# Altium project CT_Breakout_Board.PrjPCB
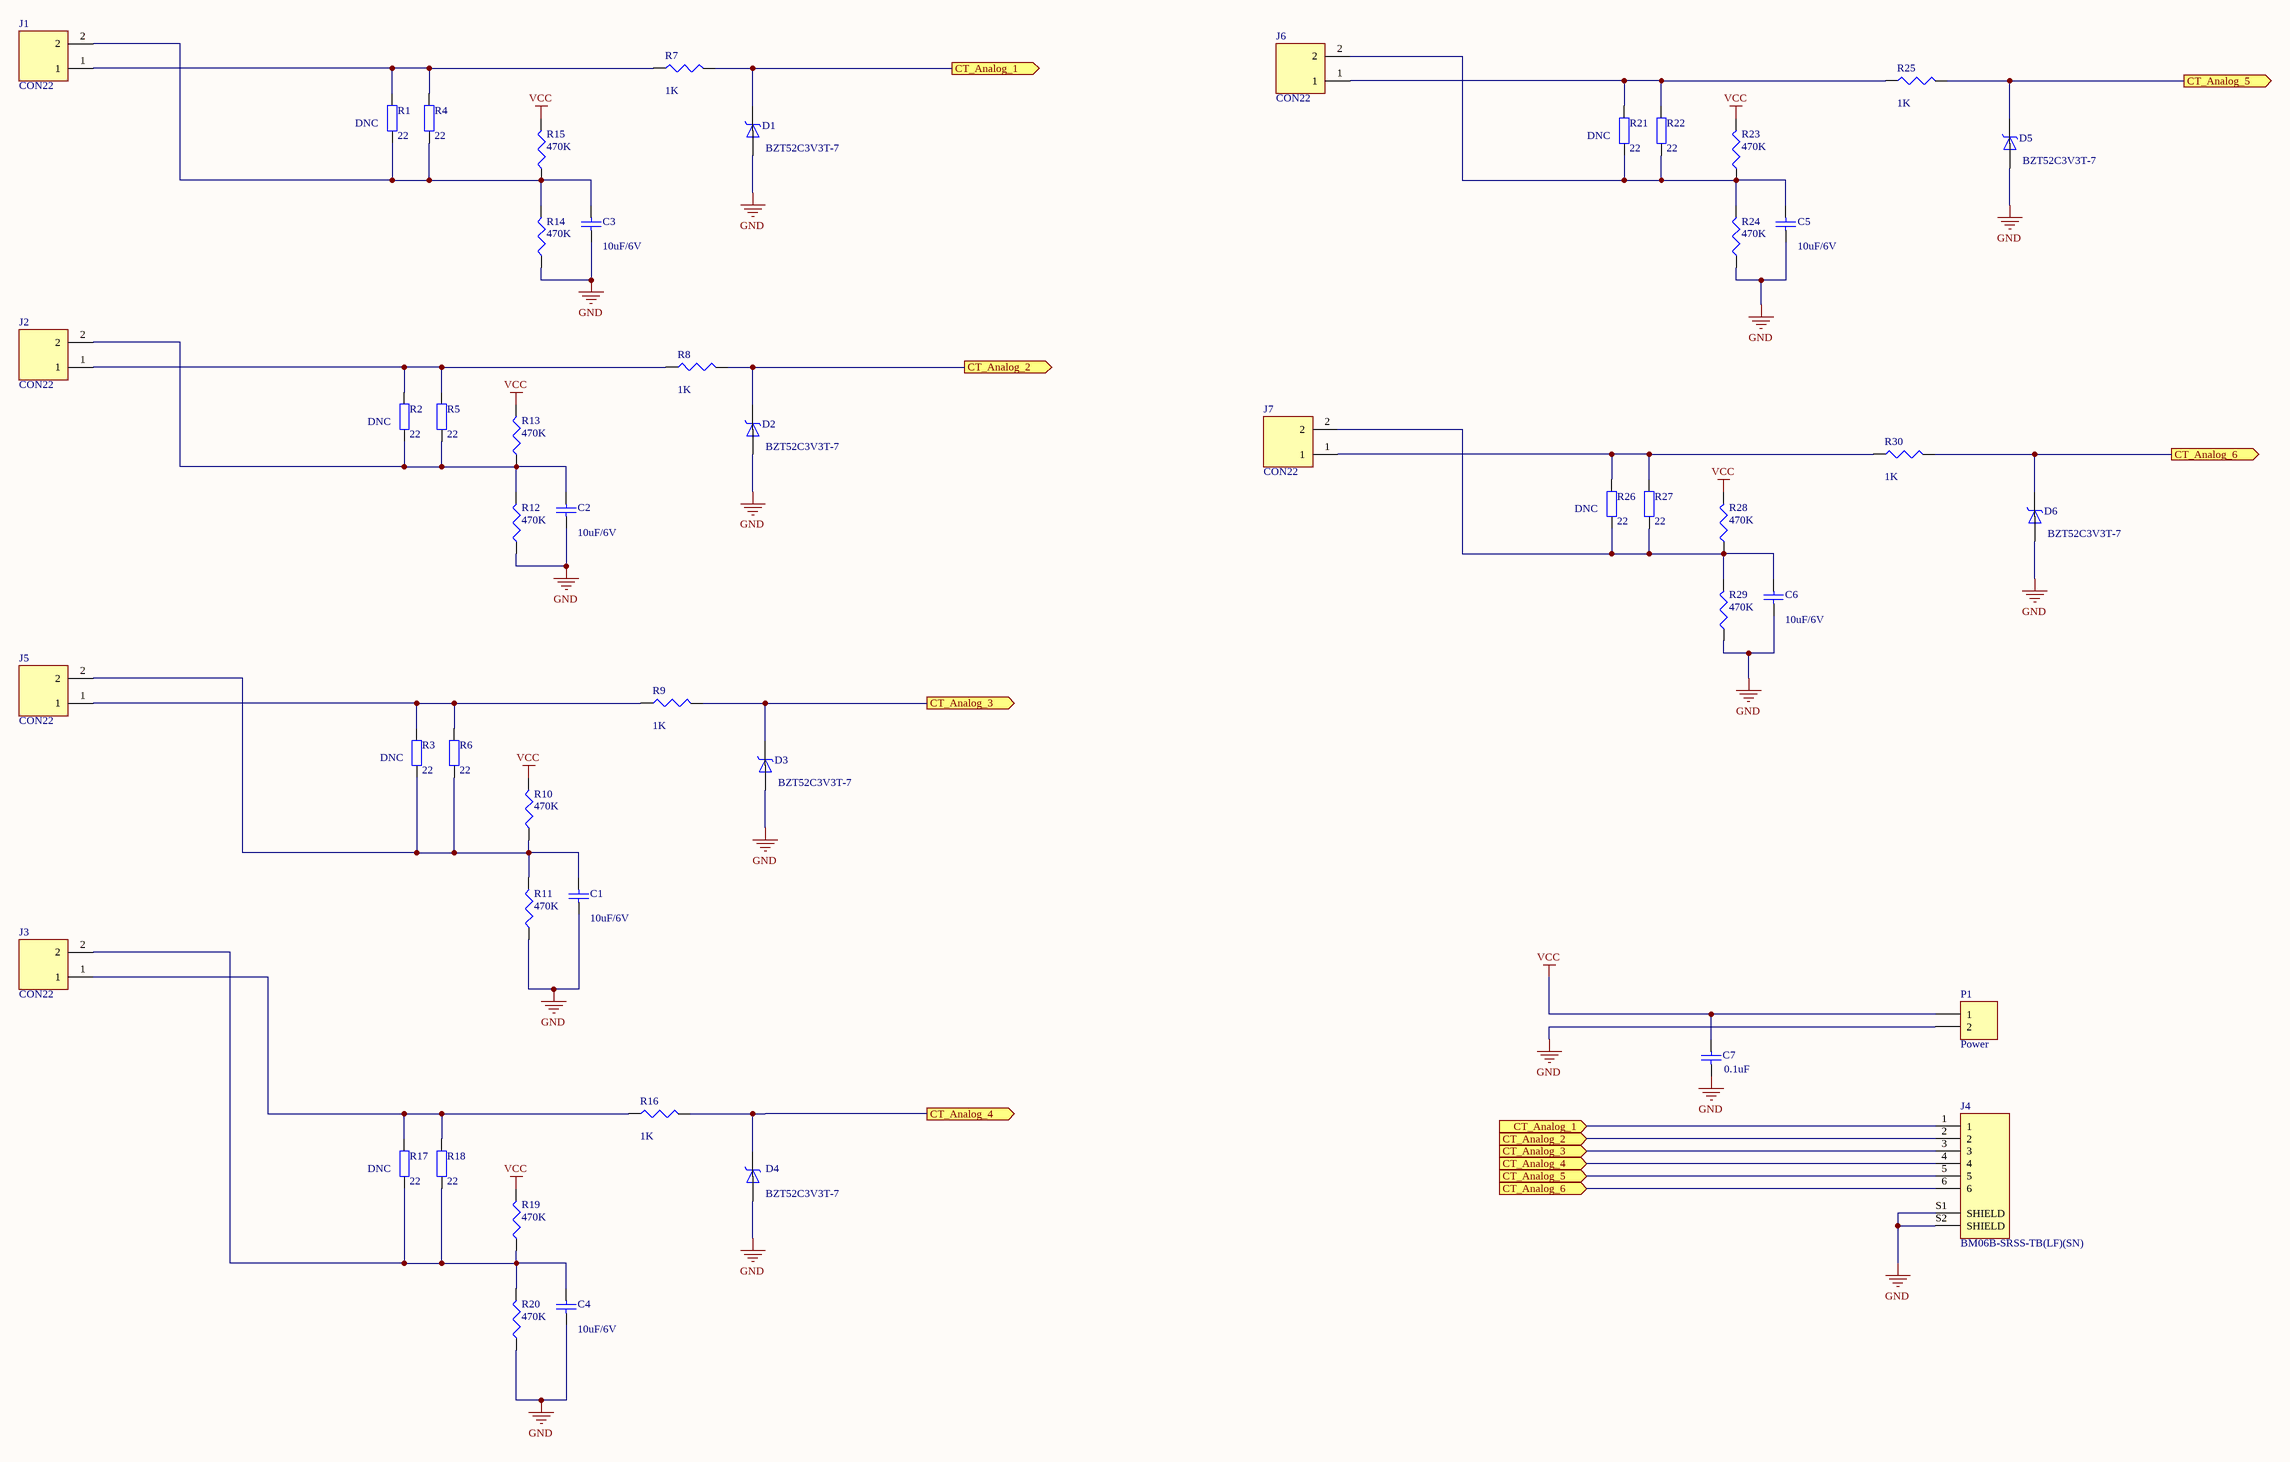
[diagram p0: CT_Breakout_Board.SchDoc]
1 sheet, 51 parts. Net scope: flat (ports and power ports of the same name join across sheets).
Board file: CT_Breakout_Board.PcbDoc

## Sheet CT_Breakout_Board.SchDoc
size OrCAD C; Organization: Altium Limited; Address1: L3, 12a Rodborough Rd; Address2: Frenchs Forest; Address3: NSW; Address4: Australia 2086

### Parts
C1  value 10uF/6V  [1608[0603]]  (hidden comment: Cap Semi)
C2  value 10uF/6V  [1608[0603]]  (hidden comment: Cap Semi)
C3  value 10uF/6V  [1608[0603]]  (hidden comment: Cap Semi)
C4  value 10uF/6V  [1608[0603]]  (hidden comment: Cap Semi)
C5  value 10uF/6V  [1608[0603]]  (hidden comment: Cap Semi)
C6  value 10uF/6V  [1608[0603]]  (hidden comment: Cap Semi)
C7  value 0.1uF  [1608[0603]]  (hidden comment: Cap Semi)
D1  BZT52C3V3T-7  [SODFL1608X65N]
D2  BZT52C3V3T-7  [SODFL1608X65N]
D3  BZT52C3V3T-7  [SODFL1608X65N]
D4  BZT52C3V3T-7  [SODFL1608X65N]
D5  BZT52C3V3T-7  [SODFL1608X65N]
D6  BZT52C3V3T-7  [SODFL1608X65N]
J1  CON22  [HANDSON_KF301-2P]
J2  CON22  [HANDSON_KF301-2P]
J3  CON22  [HANDSON_KF301-2P]
J4  BM06B-SRSS-TB(LF)(SN)  [JST_BM06B-SRSS-TB(LF)(SN)]
J5  CON22  [HANDSON_KF301-2P]
J6  CON22  [HANDSON_KF301-2P]
J7  CON22  [HANDSON_KF301-2P]
P1  Power  [HDR1X2]
R1  DNC  value 22  [AXIAL-0.4]
R2  DNC  value 22  [AXIAL-0.4]
R3  DNC  value 22  [AXIAL-0.4]
R4  22  [AXIAL-0.4]
R5  22  [AXIAL-0.4]
R6  22  [AXIAL-0.4]
R7  value 1K  [J1-0603]  (hidden comment: Res3)
R8  value 1K  [J1-0603]  (hidden comment: Res3)
R9  value 1K  [J1-0603]  (hidden comment: Res3)
R10  value 470K  [J1-0603]  (hidden comment: Res3)
R11  value 470K  [J1-0603]  (hidden comment: Res3)
R12  value 470K  [J1-0603]  (hidden comment: Res3)
R13  value 470K  [J1-0603]  (hidden comment: Res3)
R14  value 470K  [J1-0603]  (hidden comment: Res3)
R15  value 470K  [J1-0603]  (hidden comment: Res3)
R16  value 1K  [J1-0603]  (hidden comment: Res3)
R17  DNC  value 22  [AXIAL-0.4]
R18  22  [AXIAL-0.4]
R19  value 470K  [J1-0603]  (hidden comment: Res3)
R20  value 470K  [J1-0603]  (hidden comment: Res3)
R21  DNC  value 22  [AXIAL-0.4]
R22  22  [AXIAL-0.4]
R23  value 470K  [J1-0603]  (hidden comment: Res3)
R24  value 470K  [J1-0603]  (hidden comment: Res3)
R25  value 1K  [J1-0603]  (hidden comment: Res3)
R26  DNC  value 22  [AXIAL-0.4]
R27  22  [AXIAL-0.4]
R28  value 470K  [J1-0603]  (hidden comment: Res3)
R29  value 470K  [J1-0603]  (hidden comment: Res3)
R30  value 1K  [J1-0603]  (hidden comment: Res3)

### Ports
CT_Analog_1 (in), CT_Analog_1 (out), CT_Analog_2 (in), CT_Analog_2 (out), CT_Analog_3 (in), CT_Analog_3 (out), CT_Analog_4 (in), CT_Analog_4 (out), CT_Analog_5 (in), CT_Analog_5 (out), CT_Analog_6 (in), CT_Analog_6 (out)

### Nets
GND: C1.1 C2.1 C3.1 C4.1 C5.1 C6.1 C7.1 D1.A D2.A D3.A D4.A D5.A D6.A J4.S1(SHIELD) J4.S2(SHIELD) P1.2 R11.1 R12.1 R14.1 R20.1 R24.1 R29.1
VCC: C7.2 P1.1 R10.2 R13.2 R15.2 R19.2 R23.2 R28.2
NetC1_2: C1.2 J5.2 R3.1 R6.1 R10.1 R11.2
NetC2_2: C2.2 J2.2 R2.1 R5.1 R12.2 R13.1
NetC3_2: C3.2 J1.2 R1.1 R4.1 R14.2 R15.1
NetC4_2: C4.2 J3.2 R17.1 R18.1 R19.1 R20.2
NetC5_2: C5.2 J6.2 R21.1 R22.1 R23.1 R24.2
NetC6_2: C6.2 J7.2 R26.1 R27.1 R28.1 R29.2
NetD1_C: D1.C J4.1 R7.2 ; port CT_Analog_1
NetD2_C: D2.C J4.2 R8.2 ; port CT_Analog_2
NetD3_C: D3.C J4.3 R9.2 ; port CT_Analog_3
NetD4_C: D4.C J4.4 R16.2 ; port CT_Analog_4
NetD5_C: D5.C J4.5 R25.2 ; port CT_Analog_5
NetD6_C: D6.C J4.6 R30.2 ; port CT_Analog_6
NetJ1_1: J1.1 R1.2 R4.2 R7.1
NetJ2_1: J2.1 R2.2 R5.2 R8.1
NetJ3_1: J3.1 R16.1 R17.2 R18.2
NetJ5_1: J5.1 R3.2 R6.2 R9.1
NetJ6_1: J6.1 R21.2 R22.2 R25.1
NetJ7_1: J7.1 R26.2 R27.2 R30.1

### Library data of the parts
C1-C7 = Cap Semi: Capacitor (Semiconductor SIM Model); Published: 8-Jun-2000; LatestRevisionDate: 29-May-2009; LatestRevisionNote: IPC-7351 Footprint Added.; PackageReference: C1206; Publisher: Altium Limited; PackageDescription: Chip Capacitor
D1-D6 = BZT52C3V3T-7: Zener Diode 3.3V 300mW Â±6% Surface Mount SOD-523; MF: Diodes Inc.; Availability: Unavailable; MP: BZT52C3V3T-7; Price: None; Value: *; SnapEDA_Link: https://www.snapeda.com/parts/BZT52C3V3T-7/Diodes%20Inc./view-part/523569/?ref=snap; Package: SOD-523 Diodes Inc.
J1-J3 J5-J7 = KF301-2P: 2 Pin Terminal Block 5mm Pitch; MF: Handson Technology; Availability: Unavailable; MP: KF301-2P; Price: None; Value: *; SnapEDA_Link: https://www.snapeda.com/parts/KF301-2P/Handson%20Technology/view-part/4276957/?ref=snap; Package: Package
J4 = BM06B-SRSS-TB(LF)(SN): Connector Header Surface Mount 6 position 0.039 (1.00mm); MF: JST Sales; MP: BM06B-SRSS-TB(LF)(SN); Price: None; Availability: Unavailable; SnapEDA_Link: https://www.snapeda.com/parts/BM06B-SRSS-TB(LF)(SN)/JST%20Sales%20America%20Inc./view-part/317877/?ref=snap; Value: *; Package: None; BuyPart: https://www.snapeda.com/parts/BM06B-SRSS-TB(LF)(SN)/JST%20Sales%20America%20Inc./view-part/317877/?ref=eda
P1 = Header 2: Header, 2-Pin; LatestRevisionDate: 17-Jul-2002; LatestRevisionNote: Re-released for DXP Platform.; Publisher: Altium Limited
R1-R6 R17 R18 R21 R22 R26 R27 = Res2: Resistor; Published: 8-Jun-2000; LatestRevisionDate: 17-Jul-2002; LatestRevisionNote: Re-released for DXP Platform.; PackageReference: AXIAL-0.4; Publisher: Altium Limited; PackageDescription: Axial Device, Thru-Hole; 2 Leads; 0.4 in Pin Spacing
  R4-R6 R18 R22 R27: Value: 22
R7-R16 R19 R20 R23-R25 R28-R30 = Res3: Resistor; Published: 8-Jun-2000; LatestRevisionDate: 29-May-2009; LatestRevisionNote: IPC-7351 Footprint Added.; PackageReference: J1-0603; Publisher: Altium Limited; PackageDescription: Chip Resistor